# EasyEDA Pro project MasterCtrl_v1_0_4.eprj, schematic ViceSchematic

## Sheets
1 ViceCore: Board Name: ViceBoard; Create Date: 2025-08-18; Page Name: ViceCore; Project Name: MasterCtrl_v1_0_4; Schematic Name: ViceSchematic; Update Date: 2025-08-23; Company: 嘉立创EDA; Drawed: 王大智; Page Size: A4; Version: V1.0
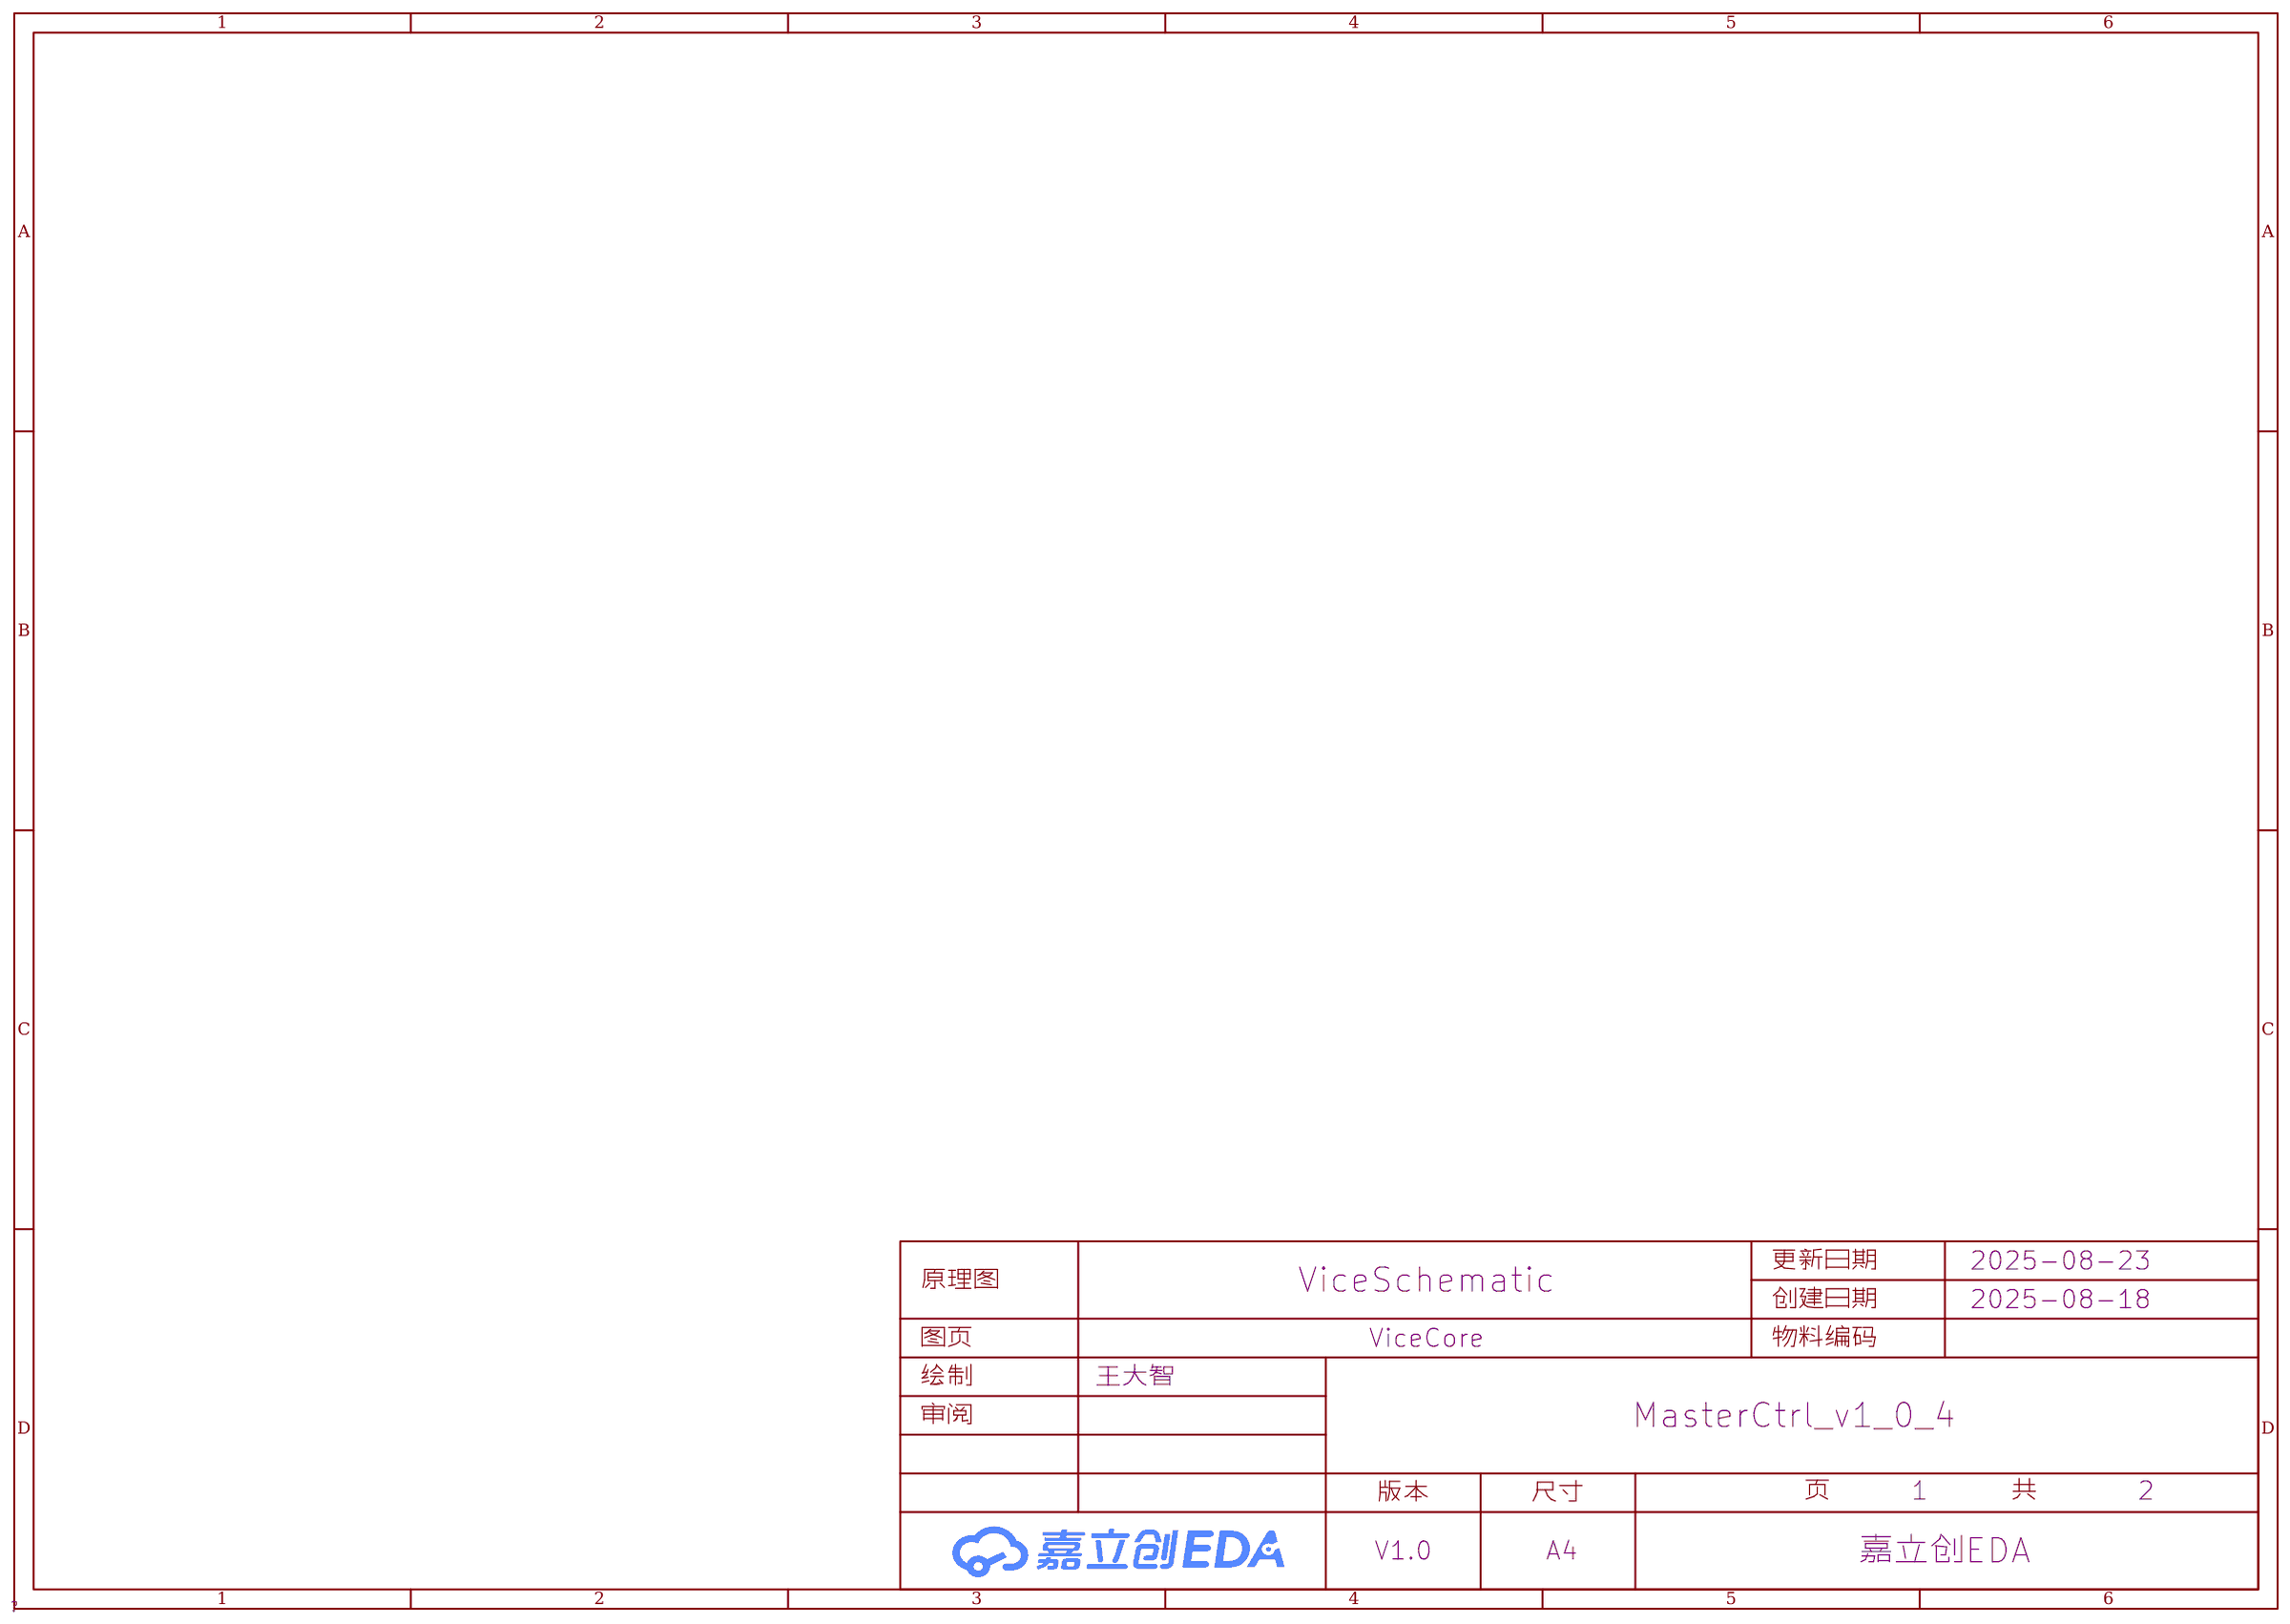
[diagram p2: ViceCore]
2 ViceExternal: Page Name: ViceExternal; Update Date: 2025-08-30
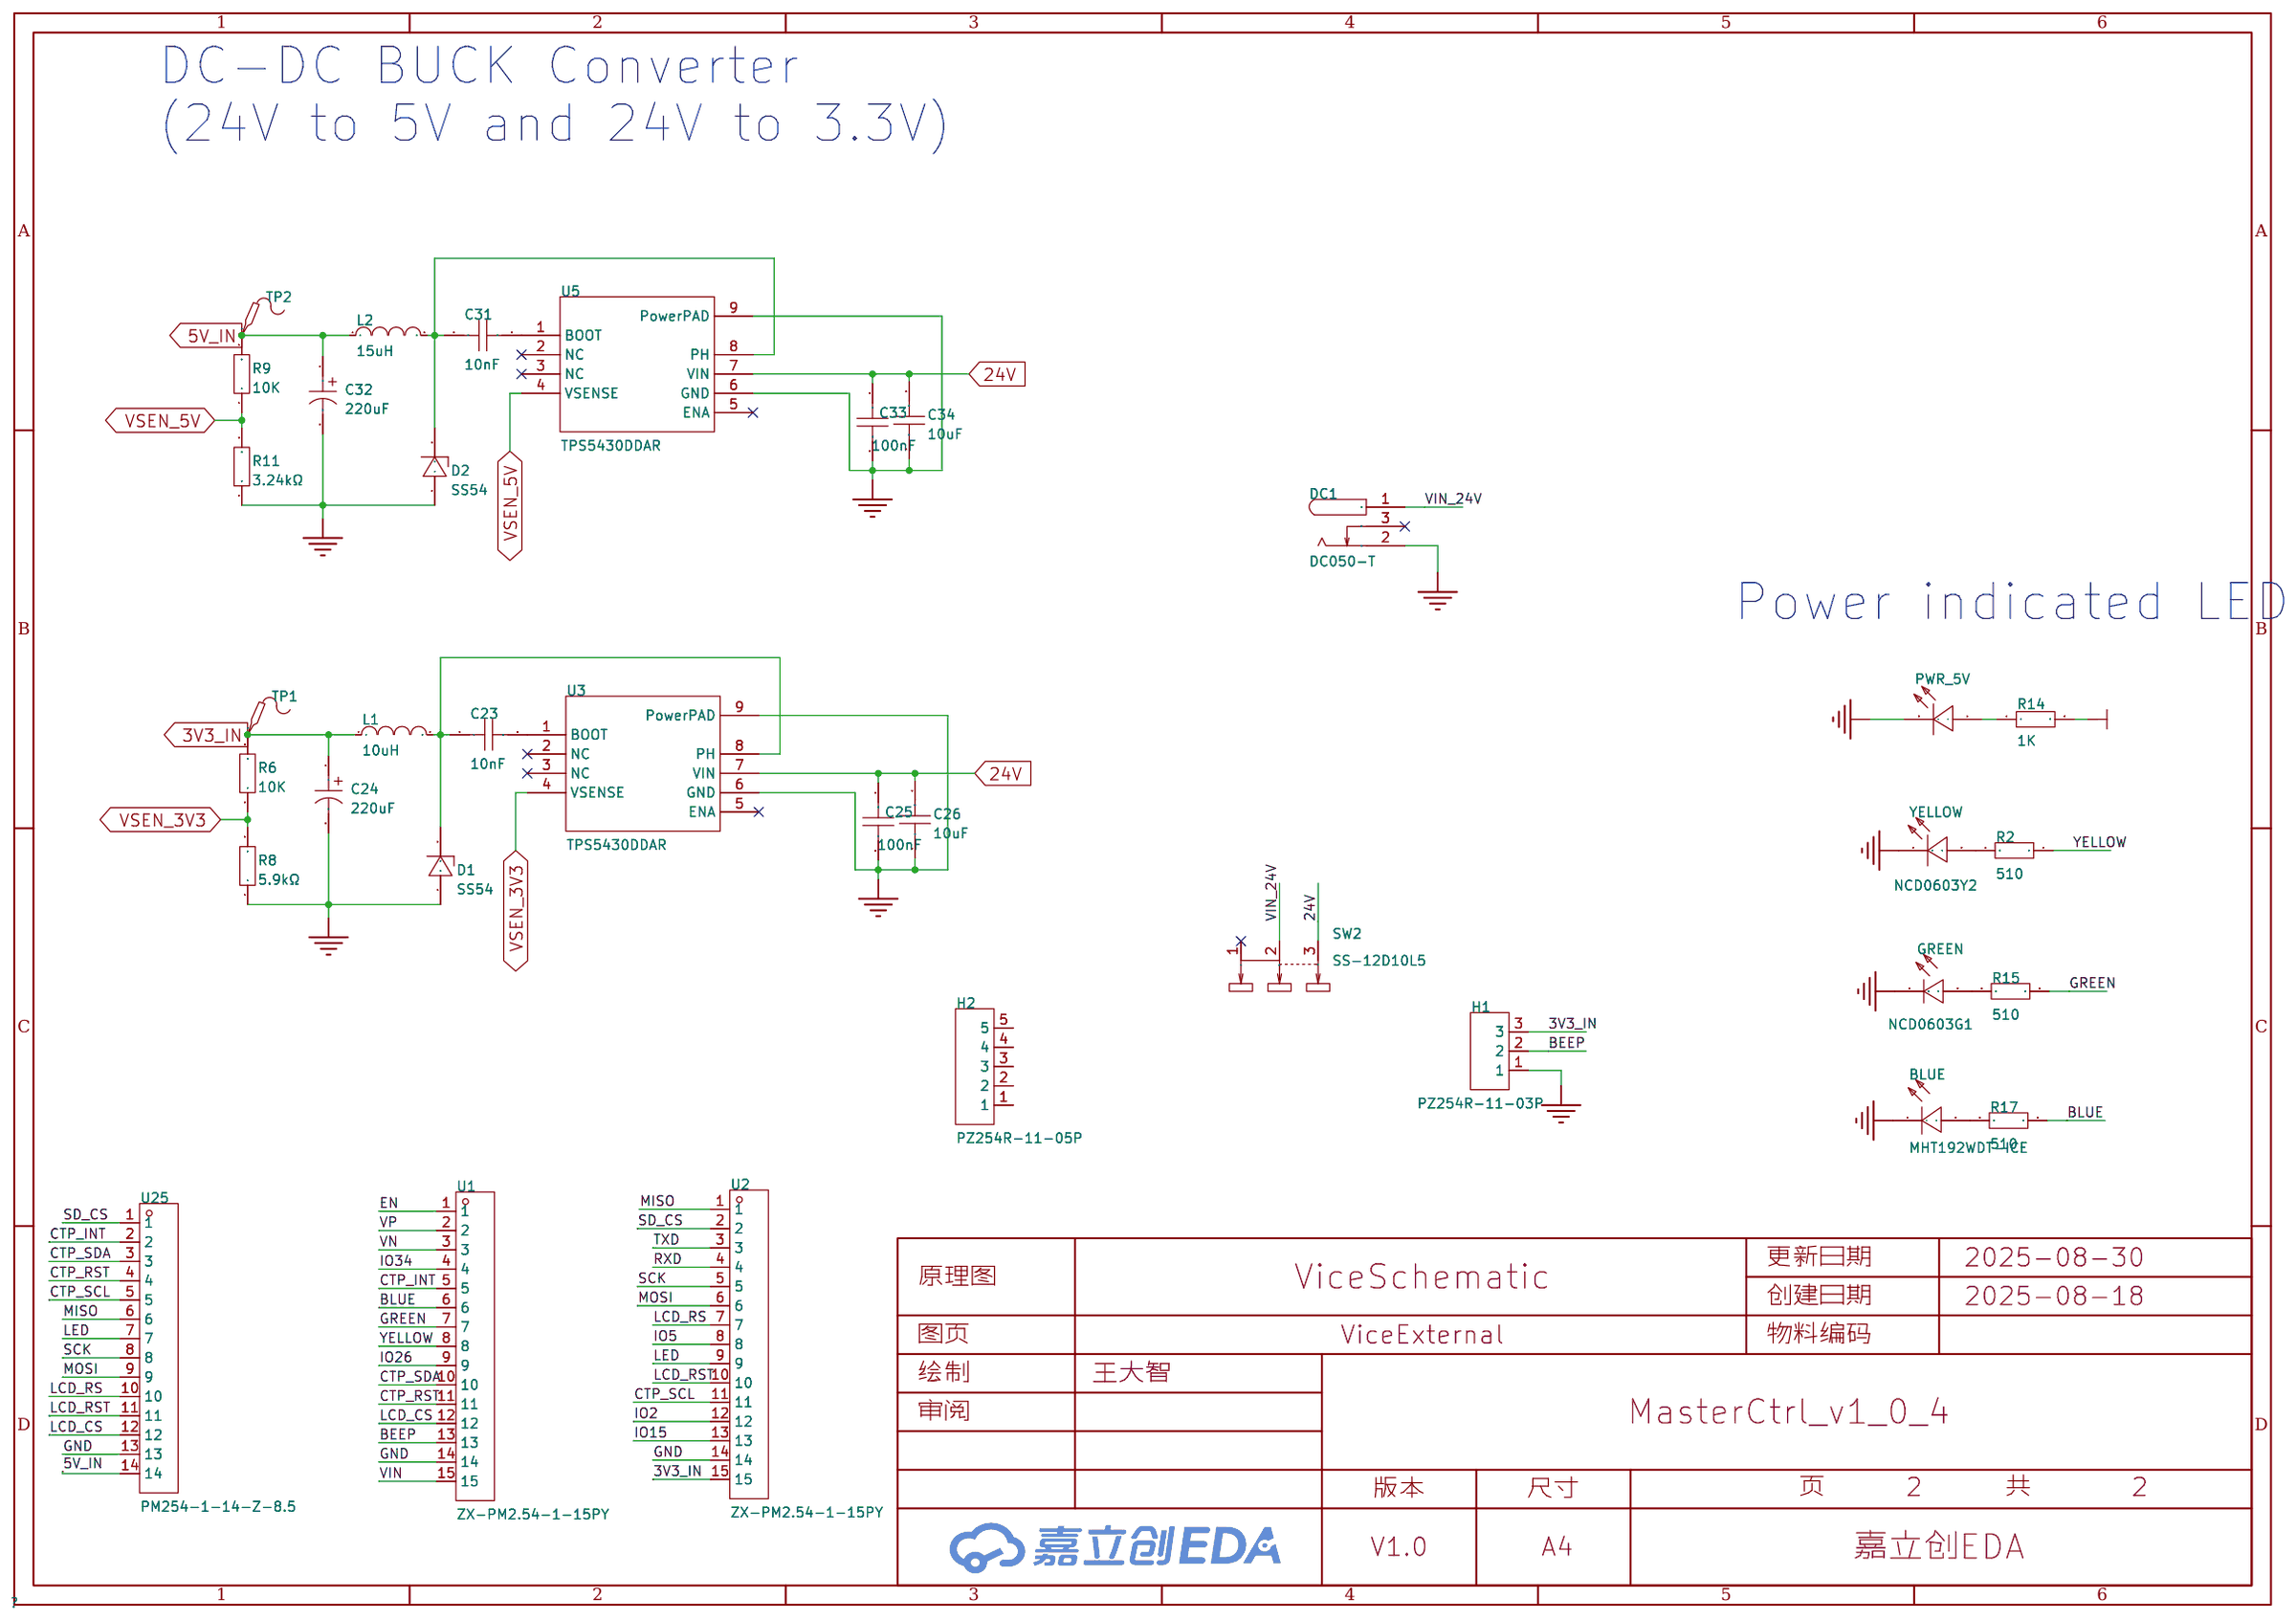
[diagram p3: ViceExternal]

## Parts
BLUE  MHT192WDT-ICE  [LED0603-RD]
C23  10nF  [C0603]
C24  220uF  [CAP-SMD_BD8.0-L8.3-W8.3-FD]
C25  100nF  [C0603]
C26  10uF  [C1206]
C31  10nF  [C0603]
C32  220uF  [CAP-SMD_BD8.0-L8.3-W8.3-FD]
C33  100nF  [C0603]
C34  10uF  [C1206]
D1  SS54  [SMA_L4.3-W2.6-LS5.0-FD]
D2  SS54  [SMA_L4.3-W2.6-LS5.0-FD]
DC1  DC050-T  [DC-IN_DC050-T]
GREEN  NCD0603G1  [LED0603-RD_1]
H1  PZ254R-11-03P  [HDR-TH_3P-P2.54-H-M-W10.4]
H2  PZ254R-11-05P  [HDR-TH_5P-P2.54-H-M-W10.4]
L1  10uH  [IND-SMD_L7.3-W6.8]
L2  15uH  [IND-SMD_L7.0-W6.6_FXL0630]
PWR_5V  SZYY0805R  [LED0805-R-RD]
R2  510  [R0603]
R6  10K  [R0603]
R8  5.9kΩ  [R0603]
R9  10K  [R0603]
R11  3.24kΩ  [R0603]
R14  1K  [R0603]
R15  510  [R0603]
R17  510  [R0603]
SW2  SS-12D10L5  [SW-TH_SS-12D10L5]
TP1  -  [Test-Point-0.5mm]
TP2  -  [Test-Point-0.5mm]
U1  ZX-PM2.54-1-15PY  [HDR-TH_15P-P2.54-V-F]
U2  ZX-PM2.54-1-15PY  [HDR-TH_15P-P2.54-V-F]
U3  TPS5430DDAR  [ESOP-8_L4.9-W3.9-P1.27-LS6.0-TL-EP]
U5  TPS5430DDAR  [ESOP-8_L4.9-W3.9-P1.27-LS6.0-TL-EP]
U25  PM254-1-14-Z-8.5  [HDR-TH_14P-P2.54-V-F-1]
YELLOW  NCD0603Y2  [LED0603-RD]

## Library data of the parts
BLUE = MHT192WDT-ICE: LCSC Part Name: 蓝灯 冰蓝; Supplier Part: C389522; Manufacturer: MEIHUA(美华); Supplier Footprint: 0603; JLCPCB Part Class: 扩展库; Datasheet: https://atta.szlcsc.com/upload/public/pdf/source/20190515/C389522_27B43B3FF0A26A72E674F8300763D196.pdf; Supplier: LCSC; Emitted Color: 冰蓝色; Power Dissipation: 95mW; Forward Current: 5mA; Lens Color: 雾状黄透镜; Viewing Angle: 130°; Operating Temperature: -35℃~+85℃
C23 C25 C31 C33 = CAP_0603: Supplier Footprint: 0603
C24 C32 = GVT1V227M0810CNVC: 容值:220uF;精度:±20%;额定电压:35V;纹波电流:175mA@120Hz;; LCSC Part Name: 220uF ±20% 35V; Supplier Part: C2983323; Manufacturer: HRK(鸿瑞凯电子); Supplier Footprint: SMD,D8xL10.5mm; JLCPCB Part Class: 扩展库; Datasheet: https://atta.szlcsc.com/upload/public/pdf/source/20220321/BA17E910A44EA2B508CDD6AB8BA576BA.pdf; Supplier: LCSC; Tolerance: ±20%; Rated Voltage: 35V; Ripple Current: 175mA@120Hz; φD: 8mm; L: 10.5mm; Lifetime @ Temp: 2000hrs@105℃; Operating Temperature: -55℃~+105℃
C26 C34 = HGC1206R5106K500NSPJ: 容值:10uF;精度:±10%;额定电压:50V;温度系数:X5R;; LCSC Part Name: 10uF ±10% 50V; Supplier Part: C7432781; Manufacturer: Chinocera(华瓷); Supplier Footprint: 1206; JLCPCB Part Class: 扩展库; Datasheet: https://atta.szlcsc.com/upload/public/pdf/source/20240320/FAC3FEC40A78BC5CCCE96C232A94D860.pdf; Supplier: LCSC; Tolerance: ±10%; Voltage Rating: 50V; Temperature Coefficient: X5R
D1 D2 = SS54_C7420369: 二极管配置:独立式;正向压降(Vf):550mV@5.0A;直流反向耐压(Vr):40V;整流电流:5A;; LCSC Part Name: 电压:40V 电流:5A; Supplier Part: C7420369; Manufacturer: 宏迦橙; Supplier Footprint: SMA(DO-214AC); JLCPCB Part Class: 扩展库; Datasheet: https://atta.szlcsc.com/upload/public/pdf/source/20230828/254C3882F8647358AD9F60DD73611B5E.pdf; Supplier: LCSC; Diode Configuration: 独立式; Forward Voltage (Vf@If): 550mV@5.0A; Reverse Voltage (Vr): 40V; Rectified Current: 5A; Reverse Leakage Current (Ir): 50uA@40V
DC1 = DC050-T: 连接器类型:DC电源插座;安装方式:卧贴;触点内径:2mm;触点外径:6.4mm;额定电流:2A;额定电压:30V;工作温度范围:-25℃~+70℃;; LCSC Part Name: DC电源插座 内径:2mm 外径:6.4mm; Supplier Part: C431534; Manufacturer: SHOU HAN(首韩); Supplier Footprint: SMD; JLCPCB Part Class: 扩展库; Datasheet: https://atta.szlcsc.com/upload/public/pdf/source/20241230/47AFDAED5CA2AEF49E0D72E48671546A.pdf; Supplier: LCSC; Connector Type: DC电源插座; Mounting Style: 卧贴; Inside Contact Diameter: 2mm; Outside Contact Diameter: 6.4mm; Current Rating (Max): 2A; Voltage Rating (Max): 30V; Operating Temperature Range: -25℃~+70℃
GREEN = NCD0603G1: Supplier Part: C84267; Manufacturer: 国星光电; Supplier Footprint: 0603; JLCPCB Part Class: 扩展库; Datasheet: https://item.szlcsc.com/datasheet/NCD0603G1/85436.html; Supplier: LCSC; Illumination Color: 翠绿色; Voltage - Forward(Vf): 2.6V~3.6V; Power(Watts): 72mW; Forward Current: 20mA; Wavelength - Dominant: 515nm~530nm; Luminous Intensity: 330mcd~900mcd; Viewing Angle: 130°; Operating Temperature: -30℃~+85℃
H1 = PZ254R-11-03P: LCSC Part Name: 1x3P 间距:2.54mm 方针 弯插; Supplier Part: C492411; Manufacturer: XFCN(兴飞); Supplier Footprint: 弯插,P=2.54mm; JLCPCB Part Class: 扩展库; Datasheet: https://item.szlcsc.com/datasheet/PZ254R-11-03P/502967.html; Supplier: LCSC; Pin Structure: 1x3P; Pitch: 2.54mm; Circluar Pins/Square Pins: 方针; Mounting Type: 弯插; Number of Rows: 单排; Number of Pins: 3P; Length of Mating Pin: 6mm; Insulation Height: 2.5mm; Contact Material: 黄铜; Operating Temperature: -40℃~+105℃; Color: 黑色
H2 = PZ254R-11-05P: 插针结构:1x5P;间距:2.54mm;行距:-;圆针/方针:方针;安装方式:弯插;排数:单排;总PIN位数:5P;额定电流:-;额定电压:-;配合针长度:6mm;塑高:2.5mm;触头材质:黄铜;触头镀层:-;工作温度:-40℃~+105℃;颜色:黑色;; LCSC Part Name: 1x5P 间距:2.54mm 方针 弯插; Supplier Part: C492413; Manufacturer: XFCN(兴飞); Supplier Footprint: 弯插,P=2.54mm; JLCPCB Part Class: 扩展库; Datasheet: https://atta.szlcsc.com/upload/public/pdf/source/20200309/C492413_82088D06BDD816AEC12FB986624DD327.pdf; Supplier: LCSC; Pin Structure: 1x5P; Pitch: 2.54mm; Circluar Pins/Square Pins: 方针; Mounting Type: 弯插; Number of Rows: 单排; Number of Pins: 5P; Length of Mating Pin: 6mm; Insulation Height: 2.5mm; Contact Material: 黄铜; Operating Temperature: -40℃~+105℃; Color: 黑色
L1 = FXL0630-100-M: 电感值:10uH;精度:±20%;额定电流:4.5A;饱和电流(Isat):5.5A;类型:一体成型电感;; LCSC Part Name: 10uH ±20% 5.5A; Supplier Part: C167223; Manufacturer: cjiang(长江微电); Supplier Footprint: SMD,6.6x7mm; JLCPCB Part Class: 扩展库; Datasheet: https://atta.szlcsc.com/upload/public/pdf/source/20240426/3189EA8206330E2108542F9E34E540E7.pdf; Supplier: LCSC; Tolerance: ±20%; Rated Current: 4.5A; Saturation Current (Isat): 5.5A; DC Resistance (DCR): 68mΩ; Type: 一体成型电感
L2 = FXL0630-150-M: 电感值:15uH;精度:±20%;额定电流:3A;饱和电流(Isat):4.5A;类型:一体成型电感;; LCSC Part Name: 15uH ±20% 4.5A; Supplier Part: C177243; Manufacturer: cjiang(长江微电); Supplier Footprint: SMD,6.6x7mm; JLCPCB Part Class: 扩展库; Datasheet: https://atta.szlcsc.com/upload/public/pdf/source/20240426/3189EA8206330E2108542F9E34E540E7.pdf; Supplier: LCSC; Tolerance: ±20%; Rated Current: 3A; Saturation Current (Isat): 4.5A; DC Resistance (DCR): 115mΩ; Type: 一体成型电感
PWR_5V = SZYY0805R: 发光颜色:红色;功率:40mW;正向电流:10mA;主波长:615nm~630nm;二极管配置:-;透镜颜色:无色透明透镜;色温:-;发光角度:120°;载带方式:-;工作温度:-40℃~+85℃;; LCSC Part Name: 红灯; Supplier Part: C434431; Manufacturer: yongyu(永裕光电); Supplier Footprint: 0805; JLCPCB Part Class: 扩展库; Datasheet: https://atta.szlcsc.com/upload/public/pdf/source/20191204/C434431_431C171B758FE4C37FA40B1B295AA7AB.pdf; Supplier: LCSC; Emitted Color: 红色; Power Dissipation: 40mW; Forward Current: 10mA; Dominant Wavelength: 615nm~630nm; Peak Wavelength: 645nm; Lens Color: 无色透明透镜; Viewing Angle: 120°; Operating Temperature: -40℃~+85℃
R2 R6 R9 R14 R15 R17 = Res_0603: Supplier Footprint: 0603
R8 = 0603WAF5901T5E: 电阻类型:厚膜电阻;阻值:5.9kΩ;精度:±1%;功率:100mW;最大工作电压:75V;温度系数:±100ppm/℃;; LCSC Part Name: 5.9kΩ ±1% 100mW 厚膜电阻; Supplier Part: C23071; Manufacturer: UNI-ROYAL(厚声); Supplier Footprint: 0603; JLCPCB Part Class: 扩展库; Datasheet: https://atta.szlcsc.com/upload/public/pdf/source/20200306/C422600_1E6D84923E4A46A82E41ADD87F860B5C.pdf; Supplier: LCSC; Type: 厚膜电阻; Tolerance: ±1%; Power(Watts): 100mW; Overload Voltage (Max): 75V; Temperature Coefficient: ±100ppm/℃; Operating Temperature Range: -55℃~+155℃
R11 = 0603WAF3241T5E: 电阻类型:厚膜电阻;阻值:3.24kΩ;精度:±1%;功率:100mW;最大工作电压:75V;温度系数:±100ppm/℃;; LCSC Part Name: 3.24kΩ ±1% 100mW 厚膜电阻; Supplier Part: C22994; Manufacturer: UNI-ROYAL(厚声); Supplier Footprint: 0603; JLCPCB Part Class: 扩展库; Datasheet: https://atta.szlcsc.com/upload/public/pdf/source/20200306/C422600_1E6D84923E4A46A82E41ADD87F860B5C.pdf; Supplier: LCSC; Type: 厚膜电阻; Tolerance: ±1%; Power(Watts): 100mW; Overload Voltage (Max): 75V; Temperature Coefficient: ±100ppm/℃; Operating Temperature Range: -55℃~+155℃
SW2 = SS-12D10L5: LCSC Part Name: 柄长5mm 直插双档 滑动开关; Supplier Part: C319012; Manufacturer: XKB Connectivity(中国星坤); Supplier Footprint: 插件; JLCPCB Part Class: 扩展库; Datasheet: https://atta.szlcsc.com/upload/public/pdf/source/20211009/D6412F37AABE6F9459A6EE7FA4DAEADB.pdf; Supplier: LCSC; Circuit: 单刀双掷; Actuator Style: 矩形柱状; Pin Style: PC引脚; Switch Length: 13mm; Switch Width: 6.8mm; Switch Height: 6.4mm; Mounting Style: 直插; Actuator Color: 黑色; Current Rating (DC): 3A; Voltage Rating (DC): 125V; Current Rating (AC): 3A; Voltage Rating (AC): 125V; Mechanical Life: 1万次; Operating Temperature: -40℃~+85℃
TP1 TP2 = Test-Point: Test Point 测试点
U1 U2 = ZX-PM2.54-1-15PY: LCSC Part Name: 1x15P 间距:2.54mm 直插; Supplier Part: C7499333; Manufacturer: Megastar(兆星); Supplier Footprint: 插件,P=2.54mm; JLCPCB Part Class: 扩展库; Datasheet: https://atta.szlcsc.com/upload/public/pdf/source/20231122/3C39A1F1F91E9B1C27921FE8D7BB9F41.pdf; Supplier: LCSC; Holes Structure: 1x15P; Pitch: 2.54mm; Circular Hole / Square Hole: 方孔; Mounting Type: 直插; Number of Rows: 单排; Number of Positions: 15P; Current Rating: 3A; Holes Direction: 顶部; Insulation Height: 8.5mm; Contact Plating: 金; Operating Temperature: -40℃~+105℃; PIN Length: 3.2mm
U3 U5 = TPS5430DDAR: 功能类型:降压型;输出类型:可调;工作电压:5.5V~36V;输出电压:1.221V~32.04V;输出电流:3A;; LCSC Part Name: 宽输入范围、3A输出电流的降压转换器; Supplier Part: C9864; Manufacturer: TI(德州仪器); Supplier Footprint: SOIC-8-EP; JLCPCB Part Class: 基础库; Datasheet: https://www.ti.com/cn/lit/gpn/tps5430; Supplier: LCSC; Function: 降压型; Output Type: 可调; Input Voltage: 5.5V~36V; Output Voltage: 1.221V~32.04V; Output Current: 3A; Switching Frequency: 500kHz; Operating Temperature: -40℃~+125℃@(TJ); Synchronous Rectification: 否; Number of Outputs: 1; Topology: 降压式; Switch tube (built-in/external): 内置
U25 = PM254-1-14-Z-8.5: LCSC Part Name: 1x14P 间距:2.54mm 直插; Supplier Part: C2897377; Manufacturer: HCTL(华灿天禄); Supplier Footprint: 插件,P=2.54mm; JLCPCB Part Class: 扩展库; Datasheet: https://atta.szlcsc.com/upload/public/pdf/source/20230609/534BE42964C679BDE98E061007C4ABD6.pdf; Supplier: LCSC; Holes Structure: 1x14P; Pitch: 2.54mm; Circular Hole / Square Hole: 方孔; Mounting Type: 直插; Number of Rows: 单排; Number of Holes: 14P; Current Rating (Max): 3A; Holes Direction: 顶部; Insulation Height: 8.5mm; Contact Material: 铜合金; Operating Temperature Range: -40℃~+105℃; Soldering Temperature(Max): 260℃@5S
YELLOW = NCD0603Y2: Supplier Part: C89811; Manufacturer: 国星光电; Supplier Footprint: 0603; JLCPCB Part Class: 扩展库; Datasheet: https://atta.szlcsc.com/upload/public/pdf/source/20200820/C89811_7FE84B429B6BCA3E113B125EE1452576.pdf; Supplier: LCSC; Emitted Color: 黄色; Forward Voltage (VF): 1.6V~2.6V; Power Dissipation: 65mW; Forward Current: 20mA; Dominant Wavelength: 586nm~595nm; Lens Color: 无色透明透镜; Luminous Intensity: 100mcd~220mcd; Viewing Angle: 130°; Operating Temperature: -30℃~+85℃

## Nets
3V3_IN: C24.1 H1.3 L1.1 R6.2 TP1.1 U2.15
5V_IN: C32.1 L2.1 R9.2 R14.2 TP2.1 U25.14
24V: C25.1 C26.2 C33.1 C34.2 SW2.3 U3.7(VIN) U5.7(VIN)
GND: BLUE.1(-) C24.2 C25.2 C26.1 C32.2 C33.2 C34.1 D1.1(A) D2.1(A) DC1.2 GREEN.1(K) H1.1 PWR_5V.2(-) R8.1 R11.1 U1.14 U2.14 U3.6(GND) U3.9(PowerPAD) U5.6(GND) U5.9(PowerPAD) U25.13 YELLOW.1(K)
VIN: U1.15
VIN_24V: DC1.1 SW2.2
BEEP: H1.2 U1.13
BLUE: R17.1 U1.6
CTP_INT: U1.5 U25.2
CTP_RST: U1.11 U25.4
CTP_SCL: U2.11 U25.5
CTP_SDA: U1.10 U25.3
EN: U1.1
GREEN: R15.1 U1.7
IO2: U2.12
IO5: U2.8
IO15: U2.13
IO26: U1.9
IO34: U1.4
LCD_CS: U1.12 U25.12
LCD_RS: U2.7 U25.10
LCD_RST: U2.10 U25.11
LED: U2.9 U25.7
MISO: U2.1 U25.6
MOSI: U2.6 U25.9
RXD: U2.4
SCK: U2.5 U25.8
SD_CS: U2.2 U25.1
TXD: U2.3
VN: U1.3
VP: U1.2
VSEN_3V3: R6.1 R8.2 U3.4(VSENSE)
VSEN_5V: R9.1 R11.2 U5.4(VSENSE)
YELLOW: R2.1 U1.8
$2N473: C23.2 U3.1(BOOT)
$2N474: C23.1 D1.2(K) L1.2 U3.8(PH)
$2N1336: C31.2 U5.1(BOOT)
$2N1337: C31.1 D2.2(K) L2.2 U5.8(PH)
$2N5426: PWR_5V.1(+) R14.1
Net-(BLUE-2): BLUE.2(+) R17.2
Net-(GREEN-2): GREEN.2(A) R15.2
Net-(R2-2): R2.2 YELLOW.2(A)

Not connected (* = marked no-connect by the designer): DC1 3*; H2 1 2 3 4 5; SW2 1*; U3 2(NC)* 3(NC)* 5(ENA)*; U5 2(NC)* 3(NC)* 5(ENA)*

## Notes on the sheets
sheet 2
- DC-DC BUCK Converter
  (24V to 5V and 24V to 3.3V)
- Power indicated LED
